# EAGLE design BareBonesArduino (EAGLE 7.3.0)
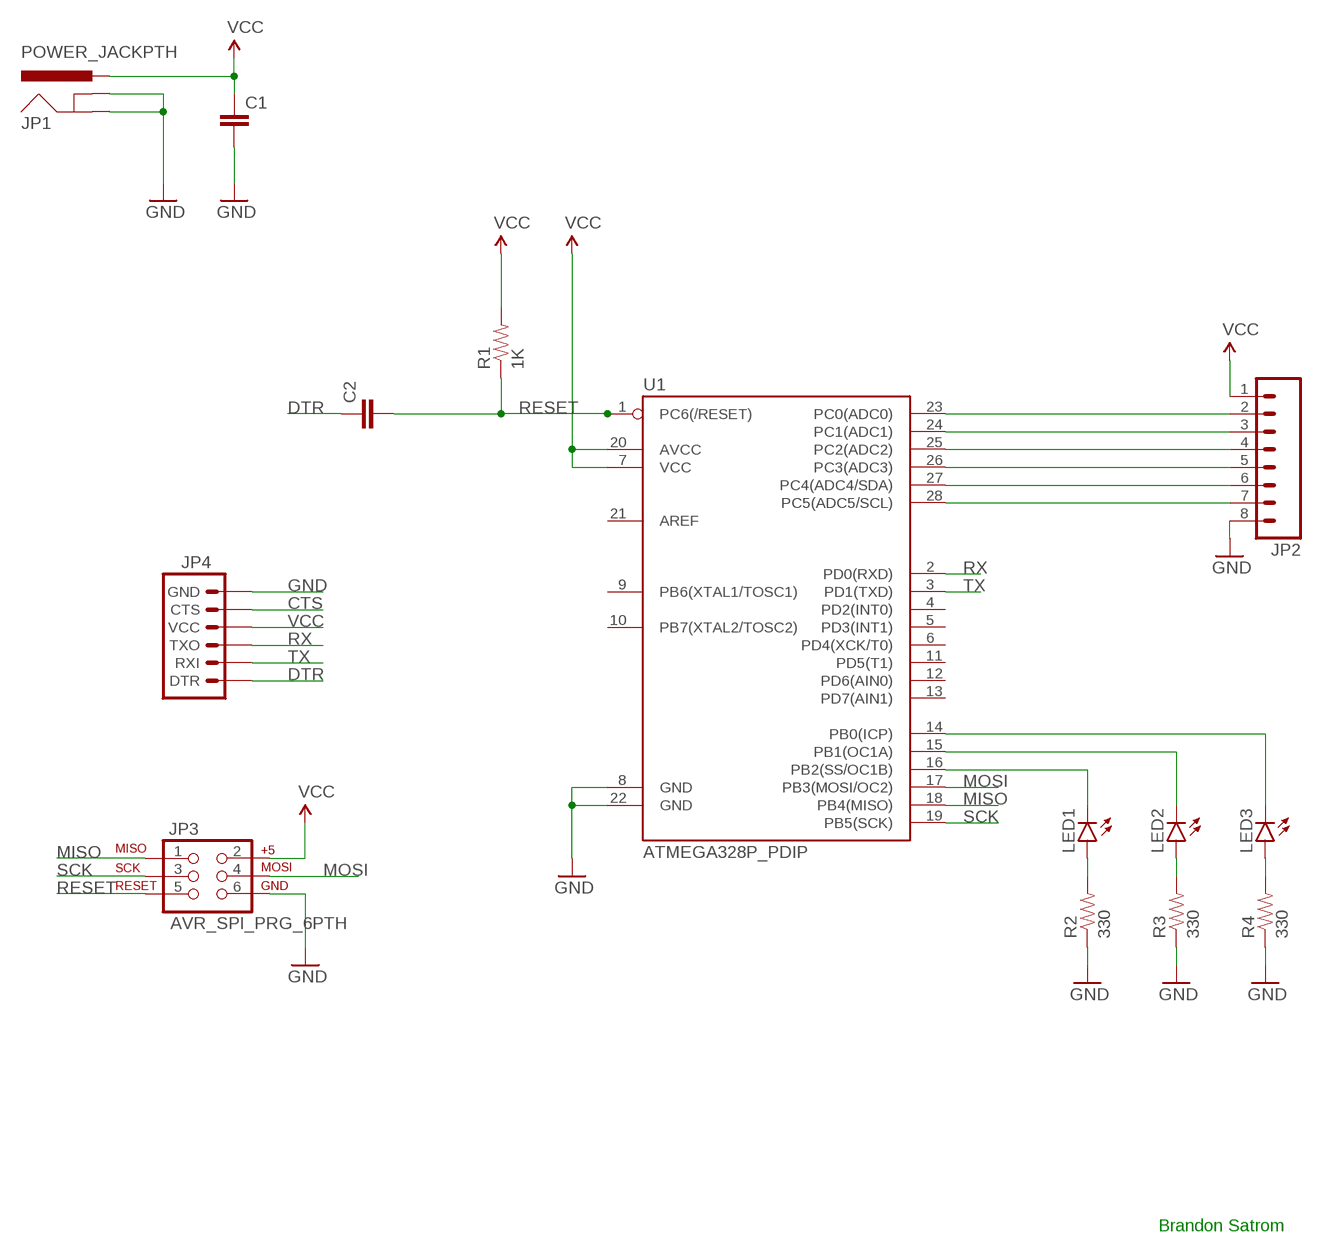
[diagram p0: schematic, sheet 1]

## Parts
C1  CAPPTH  [CAP-PTH-SMALL]
C2  CAPPTH  [CAP-PTH-SMALL]
JP1  POWER_JACKPTH  [POWER_JACK_PTH]
JP2  M08  [1X08_ROUND]
JP3  AVR_SPI_PRG_6PTH  [2X3]
JP4  ARDUINO_SERIAL_PROGRAMPTH  [1X06]
LED1  LED5MM  [LED5MM]
LED2  LED5MM  [LED5MM]
LED3  LED5MM  [LED5MM]
R1  1K  RESISTORPTH-1/4W  [AXIAL-0.4]
R2  330  RESISTORPTH-1/4W  [AXIAL-0.4]
R3  330  RESISTORPTH-1/4W  [AXIAL-0.4]
R4  330  RESISTORPTH-1/4W  [AXIAL-0.4]
U1  ATMEGA328P_PDIP  [DIL28-3]

## Nets
CTS: JP4.5(CTS)
DTR: C2.1 JP4.1(DTR)
GND: C1.2 JP1.GND JP1.GNDBREAK JP2.8 JP3.6 JP4.6(GND) R2.P$1 R3.P$1 R4.P$1 U1.8(GND) U1.22(GND)
MISO: JP3.1 U1.18(PB4(MISO))
MOSI: JP3.4 U1.17(PB3(MOSI/OC2))
N$2: JP2.2 U1.23(PC0(ADC0))
N$3: JP2.3 U1.24(PC1(ADC1))
N$4: JP2.4 U1.25(PC2(ADC2))
N$5: JP2.5 U1.26(PC3(ADC3))
N$6: JP2.6 U1.27(PC4(ADC4/SDA))
N$7: JP2.7 U1.28(PC5(ADC5/SCL))
N$8: LED3.K(C) U1.14(PB0(ICP))
N$9: LED3.A R4.P$2
N$10: LED2.A R3.P$2
N$11: LED1.A R2.P$2
N$12: LED2.K(C) U1.15(PB1(OC1A))
N$13: LED1.K(C) U1.16(PB2(SS/OC1B))
RESET: C2.2 JP3.5 R1.P$1 U1.1(PC6(/RESET))
RX: JP4.3(TXO) U1.2(PD0(RXD))
SCK: JP3.3 U1.19(PB5(SCK))
TX: JP4.2(RXI) U1.3(PD1(TXD))
VCC: C1.1 JP1.PWR JP2.1 JP3.2 JP4.4(VCC) R1.P$2 U1.7(VCC) U1.20(AVCC)
Unconnected: U1.4(PD2(INT0)) U1.5(PD3(INT1)) U1.6(PD4(XCK/T0)) U1.9(PB6(XTAL1/TOSC1)) U1.10(PB7(XTAL2/TOSC2)) U1.11(PD5(T1)) U1.12(PD6(AIN0)) U1.13(PD7(AIN1)) U1.21(AREF)

## Notes on the sheet
- Brandon Satrom

## Library data of the parts
C1 C2 = SparkFun-Capacitors:CAP: Capacitor Standard 0603 ceramic capacitor, and 0.1" leaded capacitor.
JP1 = SparkFun-Connectors:POWER_JACK: Power Jack This is the standard 5.5mm barrel jack for power. The PTH is the most common, proven, reliable, footprint. The Slot footprint only works if the mill layer is transmitted to the PCB fab house so be warned. Mating wall wart : TOL-00298 (and others); PROD_ID: CONN-08197
JP2 = SparkFun-Connectors:M08: Header 8 Standard 8-pin 0.1" header. Use with straight break away headers (SKU : PRT-00116), right angle break away headers (PRT-00553), swiss pins (PRT-00743), machine pins (PRT-00117), and female headers (PRT-00115).
JP3 = SparkFun-Connectors:AVR_SPI_PRG_6: AVR ISP 6 Pin This is the reduced ISP connector for AVR programming. Common on Arduino. This footprint will take up less PCB space and can be used with a 10-pin to 6-pin adapter such as SKU: BOB-08508 **Special note about "TEST_POINT" package. The stop mask is on the top side, so if you want your programming test points to be on the bottom of your board, make sure to place this package on the bottom side of the board. This also ensure that the orientation to program from the bottom side will be correct.
JP4 = SparkFun-Connectors:ARDUINO_SERIAL_PROGRAM: FTDI connector footprints
LED1-LED3 = SparkFun-LED:LED: LEDs Standard schematic elements and footprints for 5mm, 3mm, 1206, and 0603 sized LEDs. 5mm - Spark Fun Electronics SKU : COM-00529 (and others)
R1-R4 = SparkFun-Resistors:RESISTOR: Resistor Basic schematic elements and footprints for 0603, 1206, and PTH resistors.
U1 = SparkFun-DigitalIC:ATMEGA328P_PDIP: uC used in the Arduino 32kb flash, 1k EEPROM, 2k SRAM This is the through-hole version of this chip.

## Board
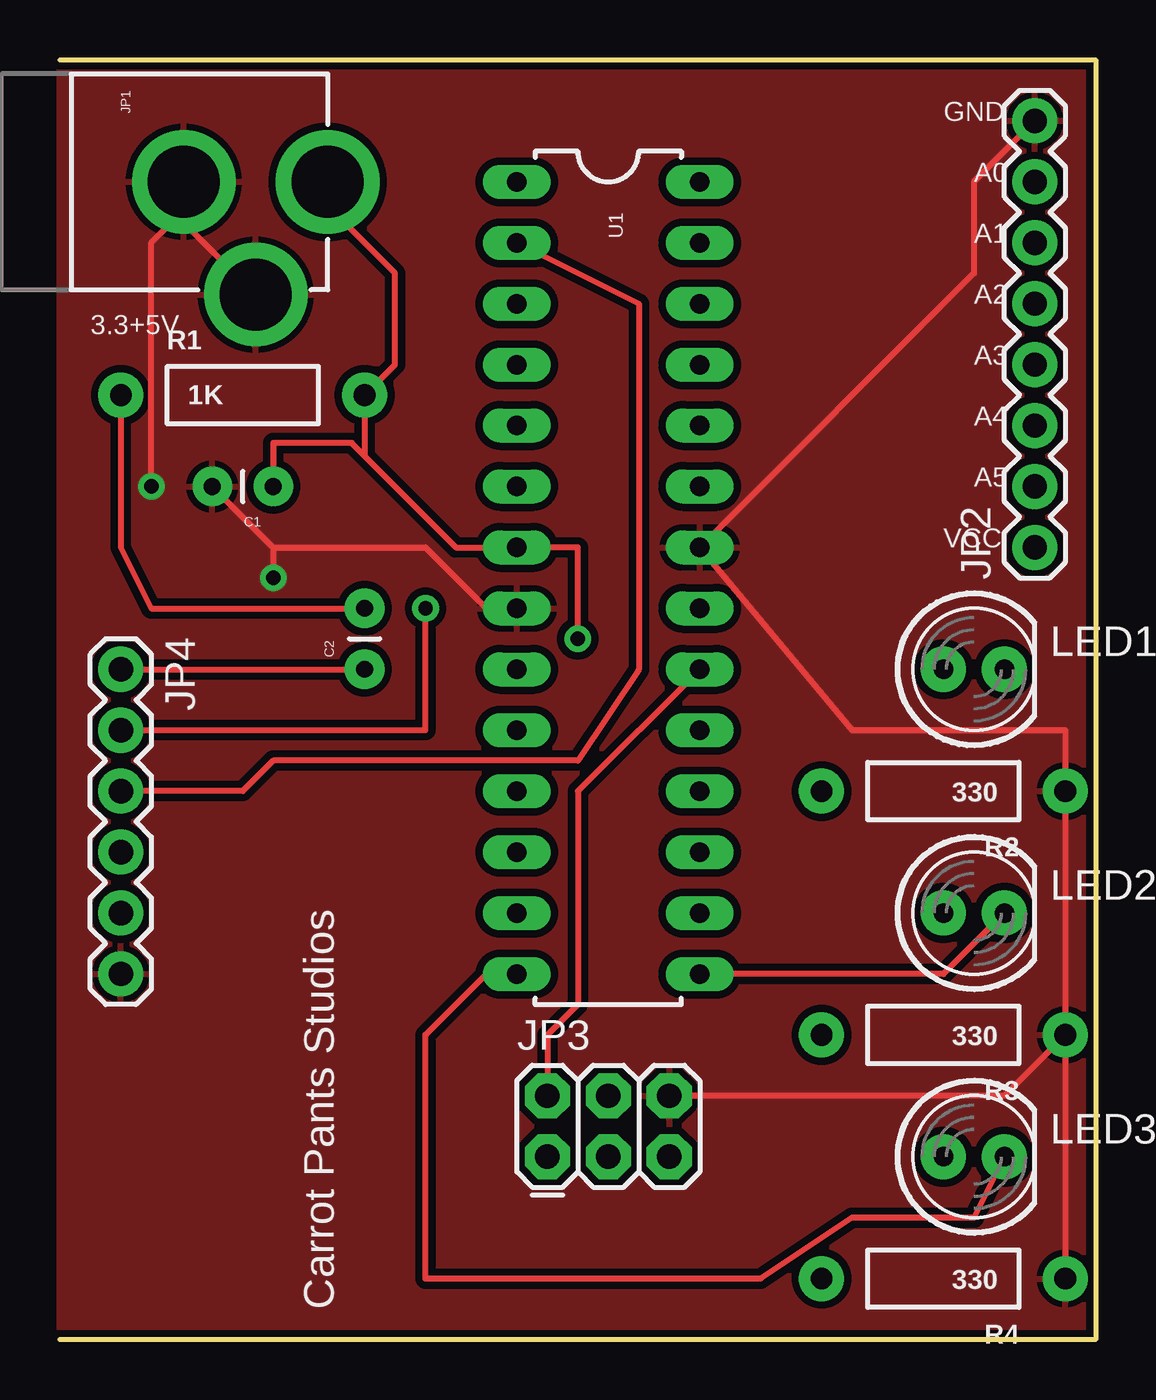
[diagram p1: board, top side]
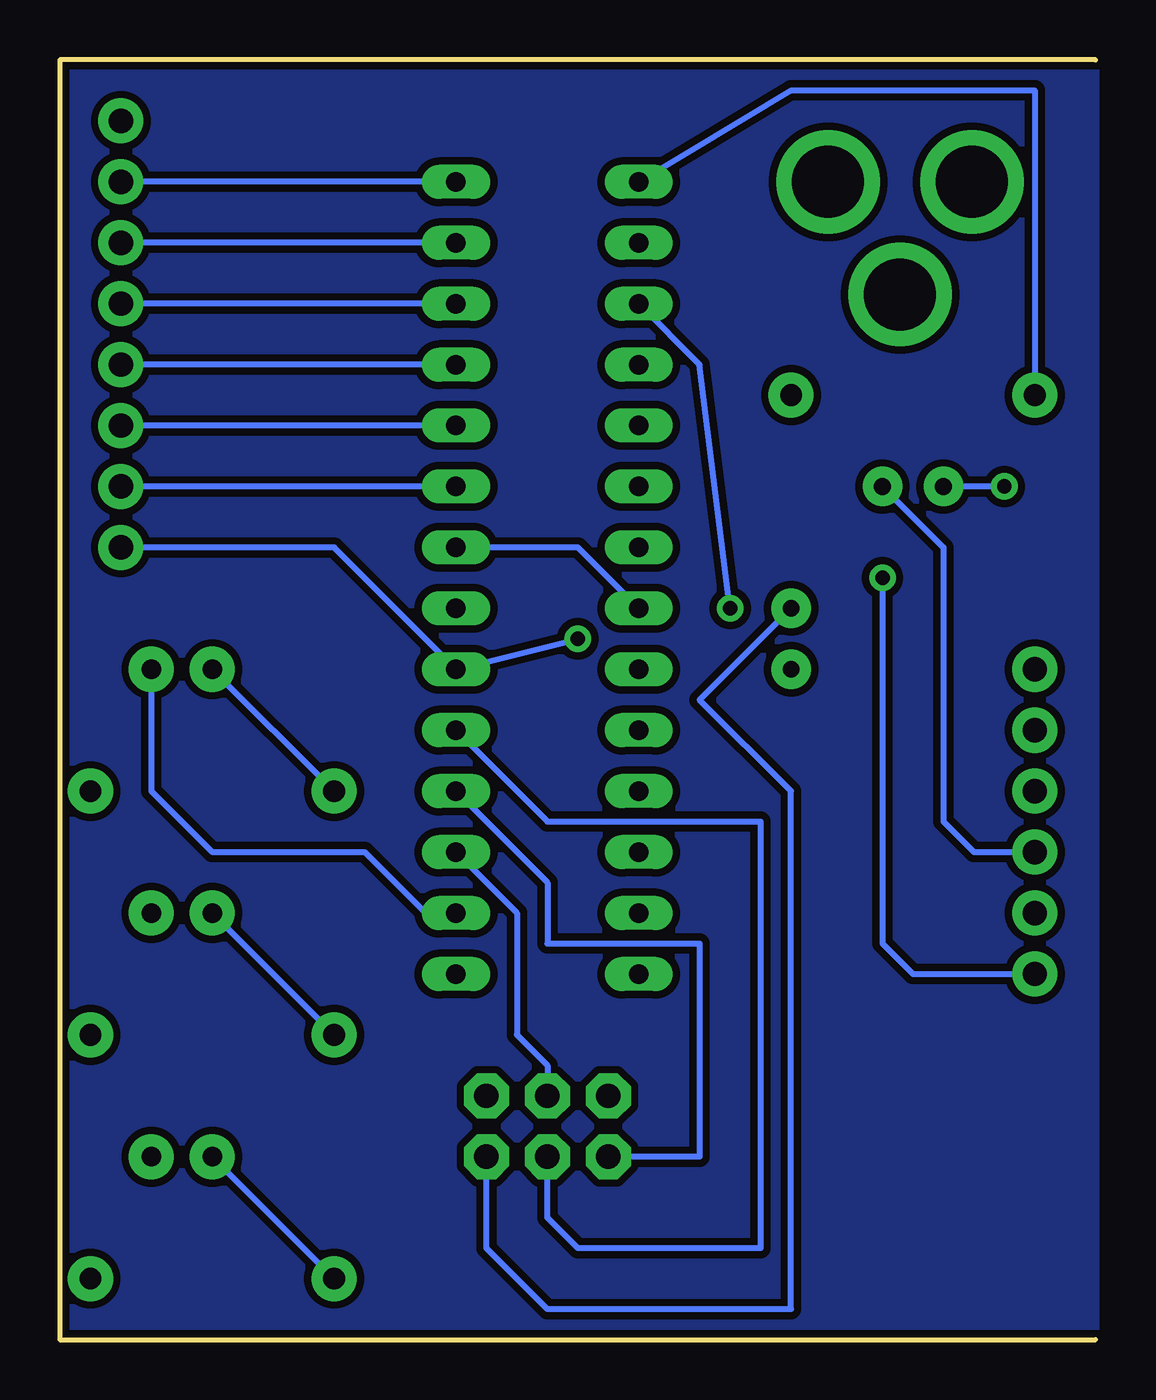
[diagram p2: board, bottom side, seen from below]

Size 43.18 x 53.34 mm. Coordinates in mm from the lower left corner, seen from the top.
Outline: 0,53.34 43.18,53.34 43.18,0 0,0
Copper layers (1*16): Top 0.035mm / dielectric 1.5mm / Bottom 0.035mm
Design rules "SparkFun": minimum track width 8mil, minimum drill 20mil, track to track 8mil, track to pad 8mil, pad to pad 8mil, via to via 8mil, smd to smd 8mil, copper to edge 8mil, drill to drill 8mil, minimum pad ring 12mil, minimum via ring 10mil, stop-mask expansion 4mil, vias tented up to drill 20mil, thermal gap 10mil

### Footprints (pad centres in the part's own frame; a part is rotated, then mirrored left to right if it is on the bottom)
CAP-PTH-SMALL = drill 0.7 pad 1.651: 1 0,0; 2 2.54,0
POWER_JACK_PTH = drill 2.997 pad 4.318: GND 0,7.7; GNDBREAK 4.7,10.7; PWR 0,13.7
1X08_ROUND = drill 1.016 pad 1.88: 1 0,0; 2 2.54,0; 3 5.08,0; 4 7.62,0; 5 10.16,0; 6 12.7,0; 7 15.24,0; 8 17.78,0
2X3 = drill 1.016 pad 1.88 octagon: 1 0,0; 2 0,2.54; 3 2.54,0; 4 2.54,2.54; 5 5.08,0; 6 5.08,2.54
1X06 = drill 1.016 pad 1.88: 1 0,0; 2 2.54,0; 3 5.08,0; 4 7.62,0; 5 10.16,0; 6 12.7,0
LED5MM = drill 0.813 pad 1.88: A -1.27,0; K 1.27,0
AXIAL-0.4 = drill 0.9 pad 1.88: P$1 -5.08,0; P$2 5.08,0
DIL28-3 = drill 0.813 long: 1 -16.51,-3.81; 2 -13.97,-3.81; 3 -11.43,-3.81; 4 -8.89,-3.81; 5 -6.35,-3.81; 6 -3.81,-3.81; 7 -1.27,-3.81; 8 1.27,-3.81; 9 3.81,-3.81; 10 6.35,-3.81; 11 8.89,-3.81; 12 11.43,-3.81; 13 13.97,-3.81; 14 16.51,-3.81; 15 16.51,3.81; 16 13.97,3.81; 17 11.43,3.81; 18 8.89,3.81; 19 6.35,3.81; 20 3.81,3.81; 21 1.27,3.81; 22 -1.27,3.81; 23 -3.81,3.81; 24 -6.35,3.81; 25 -8.89,3.81; 26 -11.43,3.81; 27 -13.97,3.81; 28 -16.51,3.81

### Placement (x,y rotation side)
C1  8.89,35.56 180 top
C2  12.7,27.94 90 top
JP1  -2.54,48.26 270 top
JP2  40.64,33.02 90 top
JP3  20.32,7.62 0 top
JP4  2.54,27.94 270 top
LED1  38.1,27.94 0 top
LED2  38.1,17.78 0 top
LED3  38.1,7.62 0 top
R1  7.62,39.37 0 top
R2  36.83,22.86 180 top
R3  36.83,12.7 180 top
R4  36.83,2.54 180 top
U1  22.86,31.75 270 top

### Tracks (layer width: path | path; a pad name or v marks a point on that pad's centre or on a via)
DTR
  Top 0.254: JP4.1 C2.1
GND  (via drill 0.6)
  Top 0.254: JP1.GND 5.08,48.26 5.08,48.18 | 5.08,48.18 5.08,46.64 JP1.GNDBREAK | JP1.GND 5.08,48.18 | C1.2 8.89,33.02 | 8.89,33.02 15.24,33.02 17.78,30.48 U1.8 | JP2.8 38.1,48.26 38.1,44.45 U1.22 33.02,25.4 41.91,25.4 R2.P$1 R3.P$1 | 8.89,33.02 v8.89,31.75 | R3.P$1 R4.P$1 | R3.P$1 39.37,10.16 JP3.6 | v3.81,35.56 3.81,45.72 5.16,47.07 JP1.GND
  Bottom 0.254: v3.81,35.56 C1.2 | U1.8 21.59,33.02 U1.22 | v8.89,31.75 8.89,16.51 7.62,15.24 JP4.6
  pour Top (isolate 0.305): 0,0 0,53.34 43.18,53.34 43.18,0
MISO
  Bottom 0.254: U1.18 22.86,19.05 22.86,16.51 16.51,16.51 16.51,7.62 JP3.1
MOSI
  Bottom 0.254: U1.17 24.13,17.78 24.13,12.7 22.86,11.43 JP3.4
N$1
  pour Bottom (isolate 0.305): 0,0 0,53.34 43.18,53.34 43.18,0
N$2
  Bottom 0.254: U1.23 JP2.2
N$3
  Bottom 0.254: U1.24 JP2.3
N$4
  Bottom 0.254: U1.25 JP2.4
N$5
  Bottom 0.254: U1.26 JP2.5
N$6
  Bottom 0.254: U1.27 JP2.6
N$7
  Bottom 0.254: U1.28 JP2.7
N$8
  Top 0.254: LED3.K 38.1,5.08 33.02,5.08 29.21,2.54 15.24,2.54 15.24,12.7 17.78,15.24 U1.14
N$9
  Bottom 0.254: LED3.A R4.P$2
N$10
  Bottom 0.254: LED2.A R3.P$2
N$11
  Bottom 0.254: LED1.A R2.P$2
N$12
  Top 0.254: LED2.K 36.83,15.24 U1.15
N$13
  Bottom 0.254: LED1.K 39.37,22.86 36.83,20.32 30.48,20.32 27.94,17.78 U1.16
RESET
  Top 0.254: R1.P$1 2.54,33.02 3.81,30.48 C2.2
  Bottom 0.254: U1.1 12.7,52.07 2.54,52.07 R1.P$1 | JP3.5 25.4,3.81 22.86,1.27 12.7,1.27 12.7,22.86 16.51,26.67 C2.2
RX
  Top 0.254: U1.2 24.13,43.18 24.13,27.94 21.59,24.13 8.89,24.13 7.62,22.86 JP4.3
SCK
  Bottom 0.254: U1.19 22.86,21.59 13.97,21.59 13.97,3.81 21.59,3.81 22.86,5.08 JP3.3
TX  (via drill 0.6)
  Top 0.254: JP4.2 15.24,25.4 v15.24,30.48
  Bottom 0.254: v15.24,30.48 16.51,40.64 U1.3
VCC  (via drill 0.6)
  Top 0.254: 12.7,36.83 R1.P$2 13.97,40.64 13.97,44.45 11.16,47.26 JP1.PWR | 12.7,36.83 16.51,33.02 U1.7 21.59,33.02 v21.59,29.21 | C1.1 8.89,37.37 12.16,37.37 12.7,36.83 | U1.20 21.59,22.86 21.59,13.97 20.32,12.7 JP3.2
  Bottom 0.254: v21.59,29.21 U1.20 31.75,33.02 JP2.1 | C1.1 6.35,33.02 6.35,21.59 5.08,20.32 JP4.4

### Text on the board
tPlace: GND | A0 | A1 | A2 | 3.3+5V | A3 | A4 | A5 | VCC | Carrot Pants Studios